# EAGLE design Raspi-Arm-Jtag (EAGLE 9.6.2)
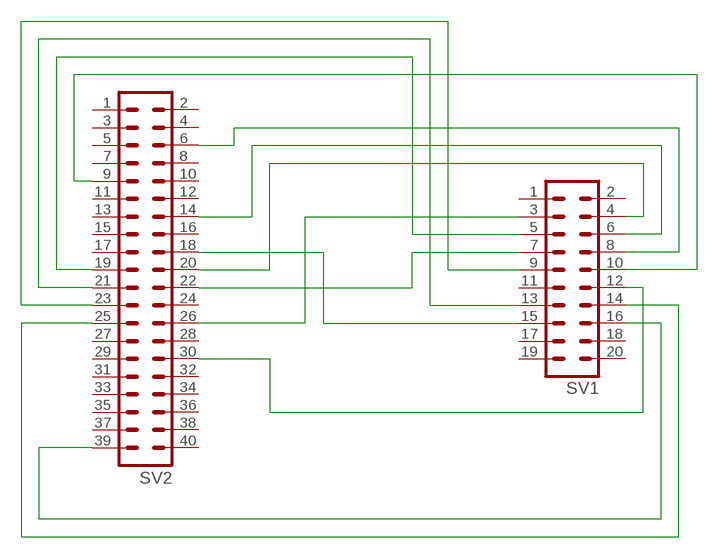
[diagram p0: schematic, sheet 1]

## Parts
SV1  ML20  [ML20]
SV2  ML40  [ML40]

## Nets
GND: SV1.4 SV1.6 SV1.8 SV1.10 SV1.12 SV1.14 SV1.16 SV2.6 SV2.9 SV2.14 SV2.20 SV2.25 SV2.30 SV2.39
N$1: SV1.5 SV2.19
N$2: SV1.3 SV2.26
N$3: SV1.7 SV2.22
N$4: SV1.9 SV2.23
N$5: SV1.13 SV2.21
N$6: SV1.15 SV2.18
Unconnected: SV1.1 SV1.2 SV1.11 SV1.17 SV1.18 SV1.19 SV1.20 SV2.1 SV2.2 SV2.3 SV2.4 SV2.5 SV2.7 SV2.8 SV2.10 SV2.11 SV2.12 SV2.13 SV2.15 SV2.16 SV2.17 SV2.24 SV2.27 SV2.28 SV2.29 SV2.31 SV2.32 SV2.33 SV2.34 SV2.35 SV2.36 SV2.37 SV2.38 SV2.40

## Library data of the parts
SV1 = con-harting-ml:ML20: HARTING; OC_FARNELL: unknown; OC_NEWARK: unknown
SV2 = con-harting-ml:ML40: HARTING; OC_FARNELL: unknown; OC_NEWARK: unknown

## Board
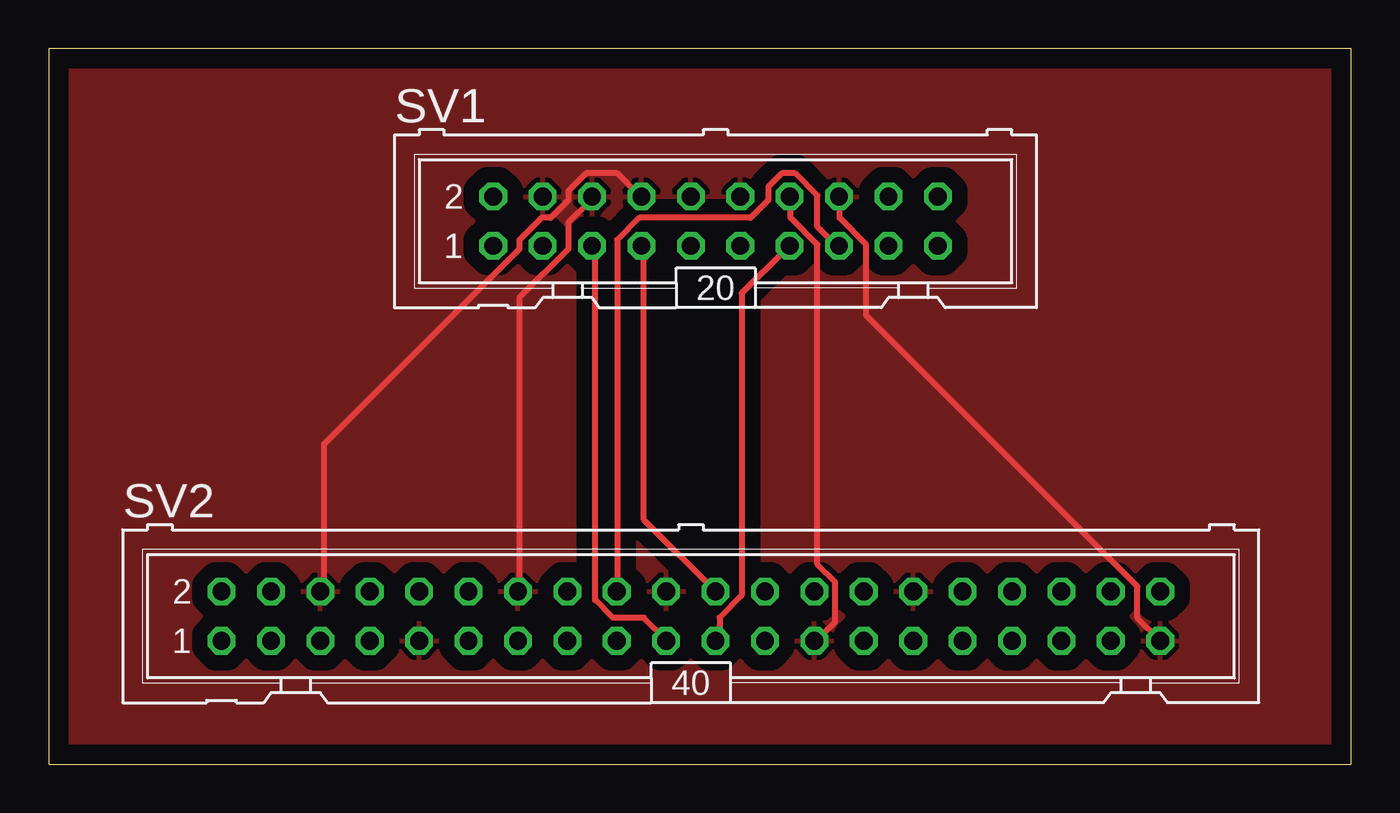
[diagram p1: board, top side]
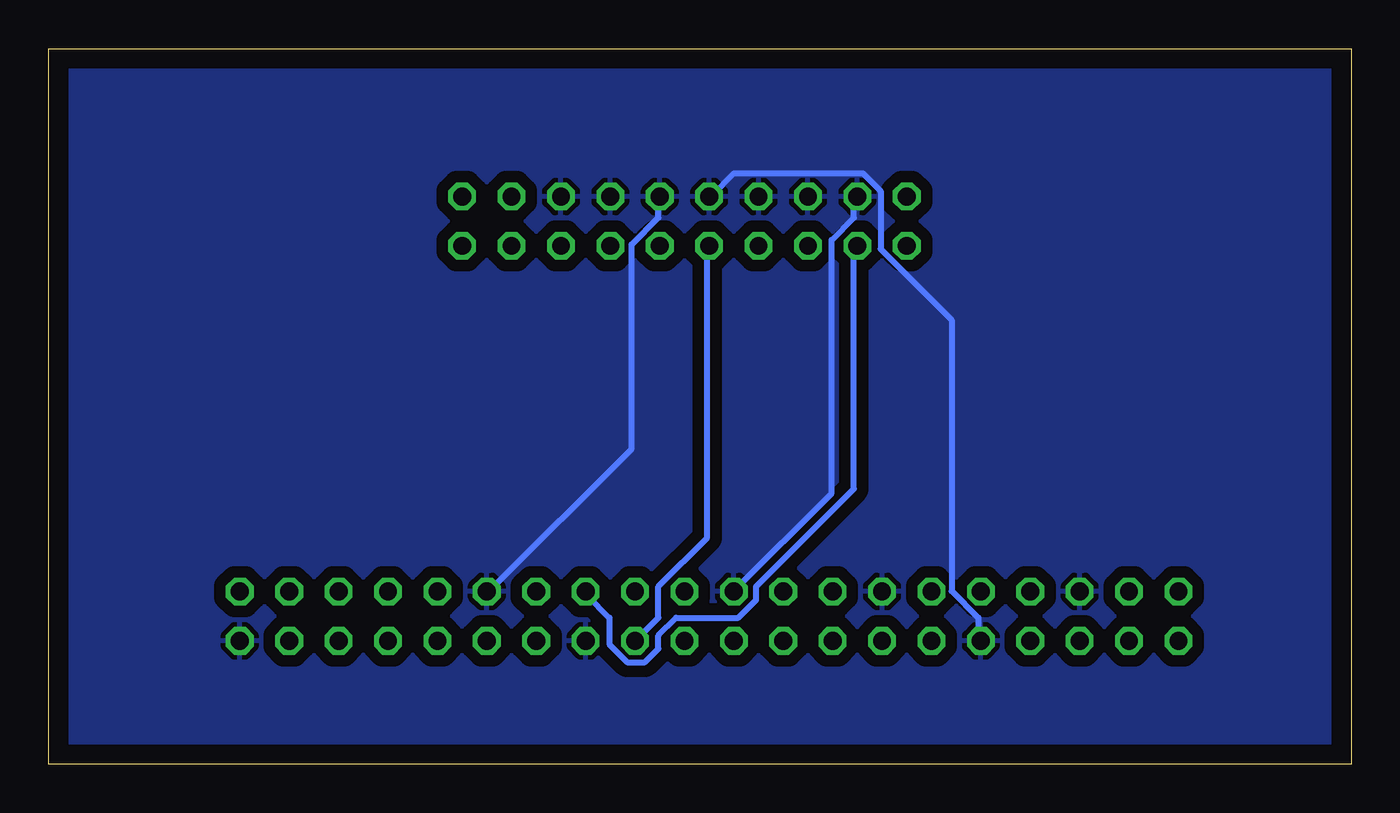
[diagram p2: board, bottom side, seen from below]

Size 66.98 x 36.82 mm. Coordinates in mm from the lower left corner, seen from the top.
Outline: 0,0 66.98,0 66.98,36.82 0,36.82 0,0
Copper layers (1*16): Top 0.035mm / dielectric 1.5mm / Bottom 0.035mm
Design rules "default *": minimum track width 12mil, minimum drill 0.35mm, track to track 6mil, track to pad 6mil, pad to pad 6mil, via to via 6mil, smd to smd 6mil, copper to edge 40mil, drill to drill 6mil, minimum pad ring 10mil, minimum via ring 8mil, stop-mask expansion 4mil, vias tented up to drill 0mil, thermal gap 10mil

### Footprints (pad centres in the part's own frame; a part is rotated, then mirrored left to right if it is on the bottom)
ML20 = drill 0.914 octagon: 1 -11.43,-1.27; 2 -11.43,1.27; 3 -8.89,-1.27; 4 -8.89,1.27; 5 -6.35,-1.27; 6 -6.35,1.27; 7 -3.81,-1.27; 8 -3.81,1.27; 9 -1.27,-1.27; 10 -1.27,1.27; 11 1.27,-1.27; 12 1.27,1.27; 13 3.81,-1.27; 14 3.81,1.27; 15 6.35,-1.27; 16 6.35,1.27; 17 8.89,-1.27; 18 8.89,1.27; 19 11.43,-1.27; 20 11.43,1.27
ML40 = drill 0.914 octagon: 1 -24.13,-1.27; 2 -24.13,1.27; 3 -21.59,-1.27; 4 -21.59,1.27; 5 -19.05,-1.27; 6 -19.05,1.27; 7 -16.51,-1.27; 8 -16.51,1.27; 9 -13.97,-1.27; 10 -13.97,1.27; 11 -11.43,-1.27; 12 -11.43,1.27; 13 -8.89,-1.27; 14 -8.89,1.27; 15 -6.35,-1.27; 16 -6.35,1.27; 17 -3.81,-1.27; 18 -3.81,1.27; 19 -1.27,-1.27; 20 -1.27,1.27; 21 1.27,-1.27; 22 1.27,1.27; 23 3.81,-1.27; 24 3.81,1.27; 25 6.35,-1.27; 26 6.35,1.27; 27 8.89,-1.27; 28 8.89,1.27; 29 11.43,-1.27; 30 11.43,1.27; 31 13.97,-1.27; 32 13.97,1.27; 33 16.51,-1.27; 34 16.51,1.27; 35 19.05,-1.27; 36 19.05,1.27; 37 21.59,-1.27; 38 21.59,1.27; 39 24.13,-1.27; 40 24.13,1.27

### Placement (x,y rotation side)
SV1  34.29,27.94 0 top
SV2  33.02,7.62 0 top

### Tracks (layer width: path | path; a pad name or v marks a point on that pad's centre or on a via)
GND
  Top 0.305: SV1.14 38.15,29.03 38.15,28.12 39.52,26.75 39.52,10.29 40.44,9.37 40.44,7.32 39.52,6.4 SV2.25 | SV1.16 40.66,29.03 40.66,28.12 42.04,26.75 42.04,23.09 55.98,9.14 55.98,7.54 57.12,6.4 SV2.39 | SV2.6 14.15,8.91 14.15,16.46 24.21,26.52 24.21,26.98 25.35,28.12 25.81,28.12 26.72,29.03 26.72,29.49 27.64,30.4 29.23,30.4 30.38,29.26 SV1.8 | SV2.14 24.21,8.91 24.21,24 26.72,26.52 26.72,27.89 27.86,29.03 SV1.6
  Bottom 0.305: SV1.12 35.64,29.03 35.64,28.12 37.01,26.75 37.01,16.23 44.32,8.91 SV2.30 | SV2.9 19.18,6.4 19.18,7.54 20.55,8.91 20.55,22.86 24.21,26.52 24.21,29.49 25.12,30.4 31.75,30.4 32.89,29.26 SV1.10 | SV1.4 25.58,29.03 25.58,28.12 26.72,26.98 26.72,13.95 31.75,8.91 SV2.20
  pour Top (isolate 0.813): 0,36.83 67.31,36.83 67.31,0 0,0
  pour Bottom (isolate 0.61): 0,36.83 67.31,36.83 67.31,0 0,0
N$1
  Top 0.305: SV1.5 28.09,26.52 28.09,8.46 29.01,7.54 30.61,7.54 31.75,6.4 SV2.19
N$2
  Bottom 0.305: SV1.3 25.58,26.52 25.58,14.17 30.61,9.14 30.61,8.46 31.52,7.54 34.72,7.54 35.64,6.63 35.64,5.94 36.32,5.26 37.24,5.26 38.15,6.17 38.15,7.54 39.29,8.69 SV2.26
N$3
  Top 0.305: SV2.22 30.61,12.57 30.61,26.52 SV1.7
N$4
  Bottom 0.305: SV2.23 35.64,7.54 35.64,9.14 33.12,11.66 33.12,26.52 SV1.9
N$5
  Top 0.305: SV2.21 34.49,6.4 34.49,7.54 35.64,8.69 35.64,24.23 37.92,26.52 SV1.13
N$6
  Top 0.305: SV2.18 29.23,8.91 29.23,26.98 30.38,28.12 36.09,28.12 37.01,29.03 37.01,29.72 37.69,30.4 38.38,30.4 39.52,29.26 39.52,27.66 40.44,26.75 SV1.15